# EAGLE design SuperSimpleEMG (EAGLE 6.5.0)
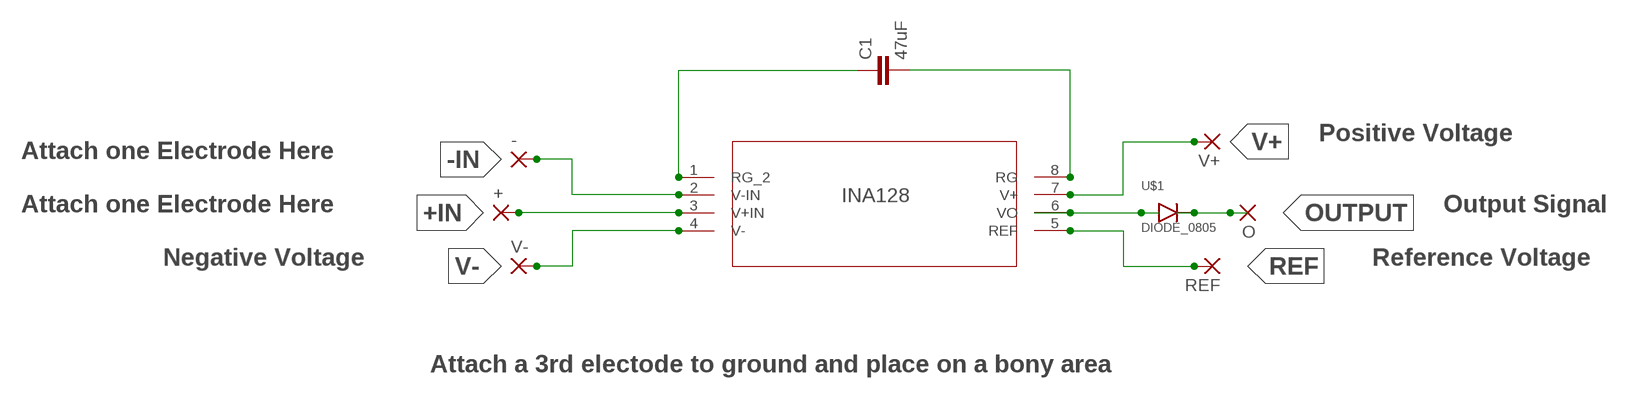
[diagram p0: schematic, sheet 1]

## Parts
+  2,15/1,0  [2,15/1,0]
-  2,15/1,0  [2,15/1,0]
C1  47uF  CAP0805  [0805]
INA128  INA128_D_8  [D8]
O  2,15/1,0  [2,15/1,0]
REF  2,15/1,0  [2,15/1,0]
U$1  DIODE_0805  [DIODE_0805]
V+  2,15/1,0  [2,15/1,0]
V-  2,15/1,0  [2,15/1,0]

## Nets
+IN: +.1(P) INA128.3(V+IN)
-IN: -.1(P) INA128.2(V-IN)
N$1: C1.1 INA128.1(RG_2)
N$2: C1.2 INA128.8(RG)
N$4: INA128.6(VO) U$1.A
OUTPUT: O.1(P) U$1.C
REF: INA128.5(REF) REF.1(P)
V+: INA128.7(V+) V+.1(P)
V-: INA128.4(V-) V-.1(P)

## Notes on the sheet
- Positive Voltage
- Attach one Electrode Here
- Attach one Electrode Here | Output Signal
- Negative Voltage | Reference Voltage
- Attach a 3rd electode to ground and place on a bony area

## Library data of the parts
+ - O REF V+ V- = wirepad:2,15/1,0: THROUGH-HOLE PAD; OC_FARNELL: unknown
C1 = SparkFun-Passives:CAP: Capacitor Standard 0603 ceramic capacitor, and 0.1" leaded capacitor.; MF: NICHICON; MPN: F980J476MSA; OC_FARNELL: 1853394
INA128 = INA128:INA128_D_8; DATASHEETURL: http://www.ti.com/lit/gpn/INA128; DESCRIPTION: Precision, Low Power Instrumentation Amplifiers; FAMILY_NAME: DUAL SUPPLY; GENERIC_PART_NUMBER: INA128; INDUSTRY_STD_PKG_TYPE: SOIC; MANUFACTURER: Texas Instruments; MANUFACTURER_PART_NUMBER: ina128_d_8; MF: TEXAS INSTRUMENTS; MPN: INA128U; OC_FARNELL: 1212413; PACKAGE_DESIGNATOR: D; PIN_COUNT: 8; VENDOR: Texas Instruments
U$1 = UniqueInteractionsLib:DIODE_0805

## Board
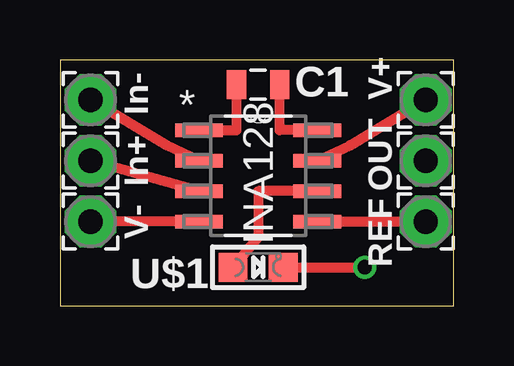
[diagram p1: board, top side]
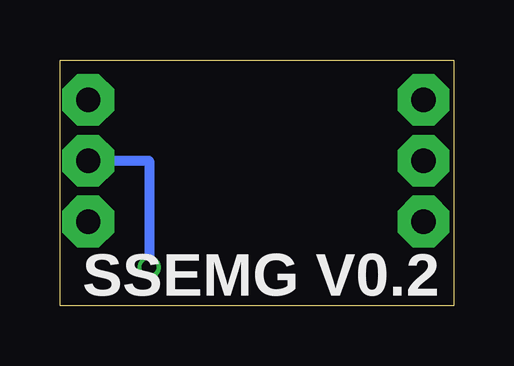
[diagram p2: board, bottom side, seen from below]

Size 16.41 x 10.26 mm. Coordinates in mm from the lower left corner, seen from the top.
Outline: 0,0 16.41,0 16.41,10.26 0,10.26 0,0
Copper layers (1*16): Top 0.0356mm / dielectric 1.5011mm / Bottom 0.0356mm
Design rules "oshParkPCBDesignRules": minimum track width 6mil, minimum drill 13mil, track to track 6mil, track to pad 6mil, pad to pad 6mil, via to via 6mil, smd to smd 6mil, copper to edge 15mil, drill to drill 6mil, minimum pad ring 7mil, minimum via ring 7mil, stop-mask expansion 3mil, vias tented up to drill 0mil, thermal gap 10mil

### Footprints (pad centres in the part's own frame; a part is rotated, then mirrored left to right if it is on the bottom)
2,15/1,0 = drill 1.016 pad 2.159 octagon: 1 0,0
0805 = smd 0.8 x 1.2: 1 -0.9,0; 2 0.9,0
D8 = smd 1.981 x 0.559: 1 -2.464,1.905; 2 -2.464,0.635; 3 -2.464,-0.635; 4 -2.464,-1.905; 5 2.464,-1.905; 6 2.464,-0.635; 7 2.464,0.635; 8 2.464,1.905
DIODE_0805 = smd 1.2 x 1.2: A 0,-1.05; C 0,1.05

### Placement (x,y rotation side)
+  1.27,6.05 0 top
-  1.27,8.59 0 top
C1  8.26,9.23 0 top
INA128  8.26,5.42 0 top
O  15.24,6.05 0 top
REF  15.24,3.52 0 top
U$1  8.26,1.61 270 top
V+  15.24,8.59 0 top
V-  1.27,3.52 0 top

### Tracks (layer width: path | path; a pad name or v marks a point on that pad's centre or on a via)
+IN
  Top 0.406: INA128.3 +.1
-IN
  Top 0.406: INA128.2 4.45,6.69 -.1
N$1
  Top 0.406: INA128.1 7.36,7.32 C1.1
N$2
  Top 0.406: INA128.8 9.15,7.32 C1.2
N$4
  Top 0.406: INA128.6 8.26,4.79 8.26,2.88 U$1.A
OUTPUT  (via drill 0.6)
  Top 0.406: U$1.C v12.7,1.61
  Bottom 0.406: O.1 12.7,6.05 v12.7,1.61
REF
  Top 0.406: INA128.5 REF.1
V+
  Top 0.406: INA128.7 12.07,6.69 V+.1
V-
  Top 0.406: INA128.4 V-.1

### Text on the board
tNames: V+ | In- | In+ | OUT | V- | REF
bNames: SSEMG V0.2